# Altium schematic sheet High-Speed-Line-Follower.SchDoc
size 420 x 297 mm; SheetNumber: 1; SheetTotal: 1
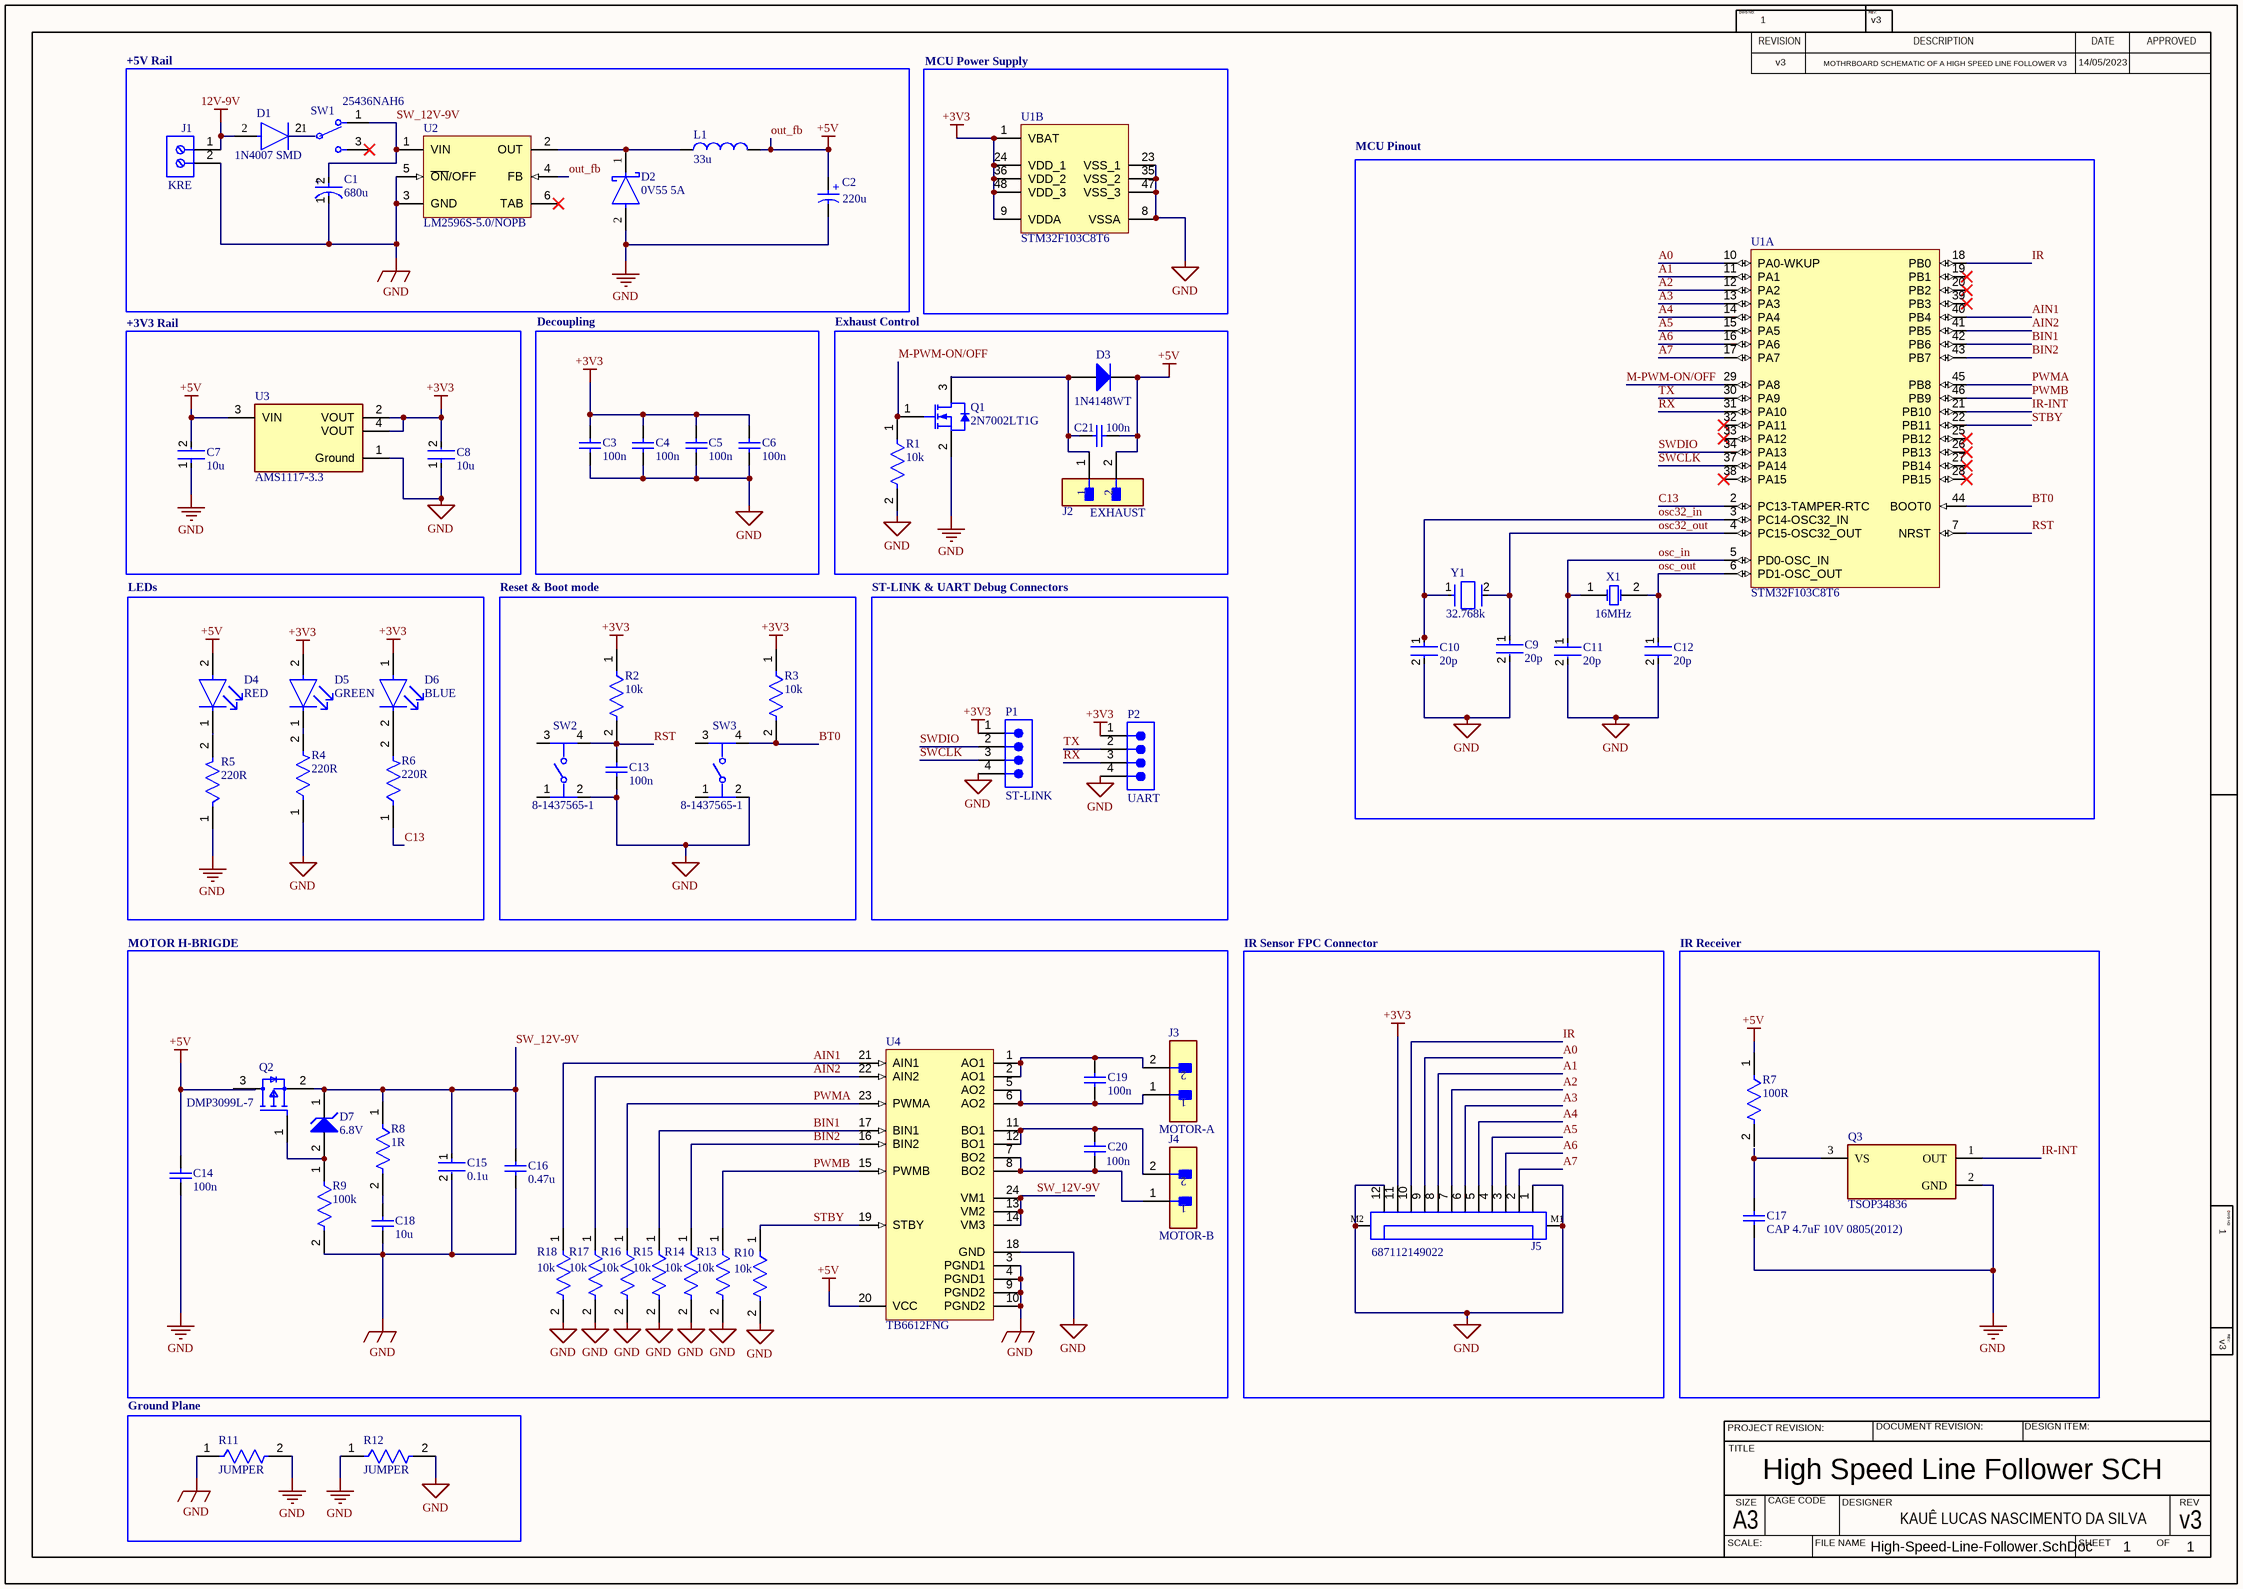
[diagram p0: High-Speed-Line-Follower.SchDoc]

## Parts
C1  680u  [FP-OS-CON-SMT-E12-MFG]
C2  220u  [WCAP-ASLI_D6.3H7.7]
C3  100n  [CAPC2013X145X50ML20T20]
C4  100n  [CAPC2013X145X50ML20T20]
C5  100n  [CAPC2013X145X50ML20T20]
C6  100n  [CAPC2013X145X50ML20T20]
C7  10u  [FP-C0805C106K8RACAUTO-MFG]
C8  10u  [FP-C0805C106K8RACAUTO-MFG]
C9  20p  [FP-C0805C-DN-MFG]
C10  20p  [FP-C0805C-DN-MFG]
C11  20p  [FP-C0805C-DN-MFG]
C12  20p  [FP-C0805C-DN-MFG]
C13  100n  [CAPC2013X140X45LL15T25]
C14  100n  [CAPC2013X140X45LL15T25]
C15  0.1u  [FP-C0805C-DN-MFG]
C16  0.47u  [CAPC2013X140X50ML20T25]
C17  CAP 4.7uF 10V 0805(2012)  [CAPC0805(2012)155_L]
C18  10u  [CAPC2013X145X50ML20T25]
C19  100n  [CAPC2013X140X45LL15T25]
C20  100n  [CAPC2013X140X45LL15T25]
C21  100n  [CAPC2013X140X45LL15T25]
D1  1N4007 SMD  [FP-1N4007_SMD-IPC_C]
D2  0V55 5A  [FP-DO-214AA-MFG]
D3  1N4148WT  [FAIR-SOD-523F-2_V]
D4  RED  [FP-SML-LXT0805IW-TR-MFG]
D5  GREEN  [FP-LTST-C171GKT-MFG]
D6  BLUE  [FP-SM0805UBWC-MFG]
D7  6.8V  [ONSC-SMB-2-403A-03_H_V]
J1  KRE  [691502710002]
J2  EXHAUST  [FP-B2B-XH-A_LF_SN-MFG]
J3  MOTOR-A  [FP-B2B-XH-A_LF_SN-MFG]
J4  MOTOR-B  [FP-B2B-XH-A_LF_SN-MFG]
J5  687112149022  [687112149022]
L1  33u  [SUMI-CDRH127_V]
P1  ST-LINK  [61300411121]
P2  UART  [61300411121]
Q1  2N7002LT1G  [ONSC-SOT-23-3-318-08_V]
Q2  DMP3099L-7  [FP-SOT23-IPC_B]
Q3  TSOP34836  [FP-6_550-5169_01-4-MFG]
R1  10k  [FP-CRGCQ0805-IPC_C]
R2  10k  [FP-CRGCQ0805-IPC_C]
R3  10k  [FP-CRGCQ0805-IPC_C]
R4  220R  [FP-AC0805-MFG]
R5  220R  [FP-AC0805-MFG]
R6  220R  [FP-AC0805-MFG]
R7  100R  [FP-CRCW0805-HPe3-IPC_C]
R8  1R  [FP-CRCW0805-e3-IPC_C]
R9  100k  [FP-MCU0805-IPC_C]
R10  10k  [FP-CRGCQ0805-IPC_C]
R11  JUMPER  [FP-HCJ0805-MFG]
R12  JUMPER  [FP-HCJ0805-MFG]
R13  10k  [FP-CRGCQ0805-IPC_C]
R14  10k  [FP-CRGCQ0805-IPC_C]
R15  10k  [FP-CRGCQ0805-IPC_C]
R16  10k  [FP-CRGCQ0805-IPC_C]
R17  10k  [FP-CRGCQ0805-IPC_C]
R18  10k  [FP-CRGCQ0805-IPC_C]
SW1  25436NAH6  [FP-25436NAH6-MFG]
SW2  8-1437565-1  [FP-8-1437565-1-MFG]
SW3  8-1437565-1  [FP-8-1437565-1-MFG]
U1  STM32F103C8T6  [STM-LQFP48_L]  (parts A,B of 2)
U2  LM2596S-5.0/NOPB  [KTT0005B_M]
U3  AMS1117-3.3  [FP-AMS1117-IPC_C]
U4  TB6612FNG  [TOSH-SSOP-24_M]
X1  16MHz  [CTS-ATS-SM-XTAL-2]
Y1  32.768k  [FP-NX2012SA-MFG]

## Blocks framed on the sheet
+5V Rail: C1 C2 D1 D2 J1 L1 SW1 U2
MCU Power Supply: U1
MCU Pinout: C9-C12 U1 X1 Y1
+3V3 Rail: C7 C8 U3
Decoupling: C3-C6
Exhaust Control: C21 D3 J2 Q1 R1
LEDs: D4-D6 R4-R6
Reset & Boot mode: C13 R2 R3 SW2 SW3
ST-LINK & UART Debug Connectors: P1 P2
MOTOR H-BRIGDE: C14-C16 C18-C20 D7 J3 J4 Q2 R8-R10 R13-R18 U4
IR Sensor FPC Connector: J5
IR Receiver: C17 Q3 R7
Ground Plane: R11 R12

## Nets
12V-9V: D1.2(A) J1.1
+3V3: C3.2 C4.2 C5.2 C6.2 C8.2 D6.1(A) J5.11 P1.1 P2.1 R2.1 R3.1 U1.1(VBAT) U1.9(VDDA) U1.24(VDD_1) U1.36(VDD_2) U1.48(VDD_3) U3.2(VOUT) U3.4(VOUT)
GND: C1.1(C) C2.2(N) C3.1 C4.1 C5.1 C6.1 C7.1 C8.1 C9.2 C10.2 C11.2 C12.2 C13.1 C14.1 C15.2 C16.1 C17.1 C18.1 D2.2(A) J1.2 J5.1 J5.12 J5.M1 J5.M2 P1.4 P2.4 Q1.2(S) Q3.2(GND) R1.2 R4.1 R5.1 R9.2 R10.2 R11.1 R11.2 R12.1 R12.2 R13.2 R14.2 R15.2 R16.2 R17.2 R18.2 SW2.2 SW3.2 U1.8(VSSA) U1.23(VSS_1) U1.35(VSS_2) U1.47(VSS_3) U2.3(GND) U2.5(~{ON}/OFF) U3.1(Ground) U4.3(PGND1) U4.4(PGND1) U4.9(PGND2) U4.10(PGND2) U4.18(GND)
out_fb: C2.1(P) C7.2 C14.2 C21.1 D3.1(K) D4.2(A) J2.2 L1.2 R7.1 U2.4(FB) U3.3(VIN) U4.20(VCC)  [also labelled +5V]
A0: J5.9 U1.10(PA0-WKUP)
A1: J5.8 U1.11(PA1)
A2: J5.7 U1.12(PA2)
A3: J5.6 U1.13(PA3)
A4: J5.5 U1.14(PA4)
A5: J5.4 U1.15(PA5)
A6: J5.3 U1.16(PA6)
A7: J5.2 U1.17(PA7)
AIN1: R18.1 U1.40(PB4) U4.21(AIN1)
AIN2: R17.1 U1.41(PB5) U4.22(AIN2)
BIN1: R15.1 U1.42(PB6) U4.17(BIN1)
BIN2: R14.1 U1.43(PB7) U4.16(BIN2)
BT0: R3.2 SW3.4 U1.44(BOOT0)
C13: R6.1 U1.2(PC13-TAMPER-RTC)
IR: J5.10 U1.18(PB0)
IR-INT: Q3.1(OUT) U1.21(PB10)
M-PWM-ON/OFF: Q1.1(G) R1.1 U1.29(PA8)
osc32_in: C10.1 U1.3(PC14-OSC32_IN) Y1.1
osc32_out: C9.1 U1.4(PC15-OSC32_OUT) Y1.2
osc_in: C11.1 U1.5(PD0-OSC_IN) X1.1(X1)
osc_out: C12.1 U1.6(PD1-OSC_OUT) X1.2(X2)
PWMA: R16.1 U1.45(PB8) U4.23(PWMA)
PWMB: R13.1 U1.46(PB9) U4.15(PWMB)
RST: C13.2 R2.2 SW2.4 U1.7(NRST)
RX: P2.3 U1.31(PA10)
STBY: R10.1 U1.22(PB11) U4.19(STBY)
SW_12V-9V: C1.2(A) C15.1 C16.2 D7.1(K) Q2.2(S) R8.1 SW1.1 U2.1(VIN) U4.13(VM2) U4.14(VM3) U4.24(VM1)
SWCLK: P1.3 U1.37(PA14)
SWDIO: P1.2 U1.34(PA13)
TX: P2.2 U1.30(PA9)
NetC17_2: C17.2 Q3.3(VS)
NetC18_2: C18.2 R8.2
NetC19_1: C19.1 J3.1 U4.5(AO2) U4.6(AO2)
NetC19_2: C19.2 J3.2 U4.1(AO1) U4.2(AO1)
NetC20_1: C20.1 J4.1 U4.7(BO2) U4.8(BO2)
NetC20_2: C20.2 J4.2 U4.11(BO1) U4.12(BO1)
NetC21_2: C21.2 D3.2(A) J2.1
NetD1_1: D1.1(C) SW1.2
NetD2_1: D2.1(C) L1.1 U2.2(OUT)
NetD4_1: D4.1(C) R5.2
NetD5_1: D5.1(C) R4.2
NetD6_2: D6.2(C) R6.2
NetD7_2: D7.2(A) Q2.1(G) R9.1

Not connected (* = marked no-connect by the designer): D5 2(A); Q1 3(D); Q2 3(D); R7 2; SW1 3*; SW2 1 3; SW3 1 3; U1 19(PB1)* 20(PB2)* 25(PB12)* 26(PB13)* 27(PB14)* 28(PB15)* 32(PA11)* 33(PA12)* 38(PA15)* 39(PB3)*; U2 6(TAB)*

## Notes on the sheet
- Labels drawn without touching a wire or pin: +3V3
- DWG NO:
- REVISION
- 1
- REV:
- v3
- DESCRIPTION
- DATE
- APPROVED
- MOTHRBOARD SCHEMATIC OF A HIGH SPEED LINE FOLLOWER V3
- 14/05/2023
- PROJECT REVISION:
- TITLE
- DOCUMENT REVISION:
- DESIGN ITEM:
- SCALE:
- A3
- SIZE
- High Speed Line Follower SCH
- CAGE CODE
- FILE NAME
- DESIGNER
- KAUÊ LUCAS NASCIMENTO DA SILVA
- SHEET
- OF
- REV
- (in symbol CMP-03913-53914576-2) +
- (in symbol CMP-05428-001321-1) +

## Library data of the parts
C1 = CMP-05428-001321-1: Conductive Polymer Aluminum Solid Capacitors (OS-CON) 680uF ±20% 16V; ESR (Equivalent Series Resistance): 14mR; Life (Hours): 1000Hour; Capacitance: 680uF; Packaging: Tape and Reel; Tolerance: 20%; Mount: Surface Mount; Case/Package: Radial; Voltage Rating: 16V; Min Operating Temperature: -55°C; Max Operating Temperature: 125°C
C2 = CMP-03913-53914576-2: WCAP-ASLI Aluminum Electrolytic Capacitors; Insulation Resistance: 454.545kΩ; Voltage Rating (DC): 16V; Life (Hours): 2000hours; ESR (Equivalent Series Resistance): 363.323mΩ; Capacitance: 220µF; Ripple Current (AC): 275mA; Impedance: 430mΩ; Leakage Current: 35.2µA; Height: 7.7mm; Case/Package: Radial; REACH SVHC: Unknown; Diameter: 6.3mm; Voltage Rating: 16V; Width: 6.6mm; Packaging: Cut Tape; Max Operating Temperature: 105°C; RoHS: Compliant; Length: 7.7mm; Min Operating Temperature: -55°C; Ripple Current: 275mA
C3-C6 = CMP-1036-04409-2: Manufacturer: Vitramon; Part Number: VJ0805Y104JXXCW1BC
C7 C8 = CMP-03020-034662-1: CAP CER 10UF 10V X7R 0805; Tolerance: 10%; Case/Package: 0805; Ratings: AEC-Q200; Packaging: Tape and Reel; Voltage Rating: 10V; Max Operating Temperature: 125°C; Min Operating Temperature: -55°C; Case Code (Metric): 2012; Case Code (Imperial): 0805; Mount: Surface Mount; RoHS Compliant: Yes; Capacitance: 10uF
C9-C12 = CMP-03020-007860-1: C0805 20 pF X8R 30ppm/°C 2.00% 10 V; Manufacturer: KEMET; Manufacturer Part Number: C0805C200G8HACTU; Tolerance: 0.02; Value: 20 pF; Material: Ceramic; Voltage Rating: 10 V; Device Class L1: Passive Components; Octopart: https://octopart.com/c0805c200g8hactu-kemet-88726762; Temperature Range High: +125°C; Capacitance: 20 pF; Temperature Coefficient: 30ppm/°C; Temperature Characteristic: X8R; Lead Free: Yes; Height: 0.88mm; Temperature Range Low: -55°C; Device Class L3: Ceramic Capacitors; Package: C0805C-DN; Automotive: No; ComponentLink2URL: https://content.kemet.com/datasheets/KEM_C1003_C0G_SMD.pdf; Device Class L2: Capacitors; Ipc Land Pattern Name: CAPC200125X78; ComponentLink2Description: Datasheet; Temperature: -55°C to +125°C; RoHS: TRUE; Category: Cap
C13 C14 C19-C21 = CMP-2007-03344-1: Part Number: GCM21BR71E104KA37L; Manufacturer: Murata
C15 = CMP-2007-00279-2: CAP CER 0.1UF 50V X7R 0805; Manufacturer Part Number: C0805C104K5RACTU; Manufacturer: KEMET; Value: 0.10 μF; Tolerance: 0.1; Temperature Coefficient: 30ppm/°C; Material: Ceramic; Device Class L2: Capacitors; Temperature Range Low: -55°C; Voltage Rating: 50 V; Digikey Description: CAP CER 0.1UF 50V X7R 0805; Category: Cap; ComponentLink2Description: Datasheet; Octopart: https://octopart.com/c0805c104k5ractu-kemet-143926; RoHS: TRUE; ComponentLink2URL: https://content.kemet.com/datasheets/KEM_C1003_C0G_SMD.pdf; Temperature Characteristic: X7R; Temperature: -55°C to +125°C; Height: 0.88mm; Temperature Range High: +125°C; Device Class L1: Passive Components; Automotive: No; Lead Free: Yes; Ipc Land Pattern Name: CAPC200125X78; Device Class L3: Ceramic Capacitors; Mouser Description: Cap Ceramic 0.1uF 50V X7R 10% SMD 2.0 x 1.2 mm 125 C Paper T/R; Capacitance: 0.10 μF; Package: C0805C-DN
C16 = CMP-2007-03294-1: Part Number: C0805C474K3NACTU; Manufacturer: Kemet
C17 = CMP-1036-04882-1: CAP 4.7uF 10V ±10% 0805 (2012 Metric) Thickness 1.55mm SMD; Case-EIA: 0805; Tolerance: Â±10%; Case-Metric: 2012; Rated Voltage: 10 V; Max Thickness: 1.55 mm; Technology: SMT; Value: 4.7uF
C18 = CMP-2007-01018-1: Part Number: C0805C106M4PACTU; Manufacturer: Kemet
D1 = CMP-12389-000001-1: Rectifier, 1Kv, 1A, Do-214Ac Rohs Compliant: Yes
D2 = CMP-00252-99177889-1: 5819SMJE3/TR13 Rectifier Diode, Schottky, 1 Phase, 1 Element, 1A, 40V V(RRM), Silicon; Peak Non-Repetitive Surge Current: 50A; Peak Reverse Current: 1mA; Element Configuration: Single; Capacitance: 50pF; Forward Voltage: 850mV; Max Junction Temperature (Tj): 150°C; Schedule B: 8541100080; Packaging: Tape & Reel (TR); Max Reverse Voltage (DC): 40V; Height: 2.41mm; Lead Free: Lead Free; Number of Pins: 2; Radiation Hardening: No; Average Rectified Current: 1A; Max Forward Surge Current (Ifsm): 50A; Max Repetitive Reverse Voltage (Vrrm): 40V; Case/Package: SMB; Reverse Voltage: 40V; NexarPartId: 99177889; Min Operating Temperature: -55°C; Lifecycle Status: Production; Max Operating Temperature: 150°C; RoHS: Compliant; Mount: Surface Mount; Forward Current: 1A; Reverse Voltage (DC): 40V
D3 = CMP-0881-00001-1: High Conductance Fast Switching Diode, 75 V, -55 to 150 degC, 2-Pin SOD523F, RoHS; Manufacturer: Fairchild Semiconductor; IR (VR: 75 V)=5 uA Max.; VF: 1 V Max.; BVR (IR: 5 uA)=75 V Min.; CO: 4 pF Max.; DatasheetVersion: Rev. A2; ComponentLink1Description: Manufacturer URL; PackageDescription: 2-Pin Surface Mount Device, Body 1.2 x 0.8 mm, Height 0.7 mm; ComponentLink2URL: http://www.fairchildsemi.com/ds/1N/1N4148WT.pdf; ComponentLink2Description: Datasheet; PartNumber: 1N4148WT; ComponentLink1URL: http://www.fairchildsemi.com/; Temperature Range: -55 to 150 degC; Mounting Technology: Surface Mount; PackageReference: SOD-523F-2; RoHS: TRUE
D4 = CMP-1724-00002-2: LED RED DIFFUSED SMD; Lens Style: Rectangular; Luminous Intensity: 11mcd; Approvals: UL; Test Current: 20mA; Forward Voltage: 2V; Number of LEDs: 1; Wavelength: 635nm; Lens Color: White; Viewing Angle: 140°; Min Operating Temperature: -25°C; Case Code (Metric): 2012; Mount: Surface Mount; Case Code (Imperial): 0805; Height: 0.8mm; Lead Free: Lead Free; Color: Red; Package Quantity: 1; Illumination Color: Red; Lens Transparency: Diffused; Forward Current: 20mA; Packaging: Tape and Reel; Length: 2mm; Case/Package: 0805; REACH SVHC: No SVHC; Width: 1.25mm; Number of Pins: 2; Max Operating Temperature: 80°C; Dominant Wavelength: 635nm
D5 = CMP-22017-000007-1: LED GREEN CLEAR CHIP SMD; Luminous Intensity: 12mcd; Lens Color: Colorless; Dominant Wavelength: 569nm; Number of LEDs: 1; Power Dissipation: 100mW; Viewing Angle: 130°; Reverse Voltage: 5V; Test Current: 10mA; Forward Voltage: 2.1V; Wavelength: 585nm; Lens Style: Diffused; Forward Current: 30mA; Height: 0.8mm; Mount: Surface Mount; Package Quantity: 1; Length: 2mm; Case Code (Metric): 2012; Number of Pins: 2; Number of Elements: 1; Packaging: Tape and Reel; Color: Green; Min Operating Temperature: -55°C; Case/Package: 0805; Power Rating: 100mW; Max Operating Temperature: 85°C; Radiation Hardening: No; Depth: 1.25mm; Lens Transparency: Clear; Width: 1.25mm; Lead Free: Lead Free; Case Code (Imperial): 0805; Illumination Color: Green
D6 = CMP-35283-000004-1: LED BLUE CLEAR 0805 SMD; Dominant Wavelength: 470nm; Forward Voltage: 3.3V; Forward Current: 20mA; Lens Color: Colorless; Lens Style: Rectangular; Luminous Intensity: 115mcd; Viewing Angle: 130°; Power Rating: 100mW; Lens Transparency: Clear; Height: 1.1mm; Mount: Surface Mount; Packaging: Tape and Reel; Package Quantity: 3000; Illumination Color: Blue; Width: 1.2mm; Min Operating Temperature: -30°C; Case Code (Imperial): 0805; Length: 2mm; Test Current: 20mA; Max Operating Temperature: 80°C; Case Code (Metric): 2012; Color: Blue; Wavelength: 470nm; Case/Package: 0805; Lead Free: Lead Free; Number of Pins: 2
D7 = CMP-1060-00231-1: 3 W Zener Voltage Regulator, 2-Pin SMB, Pb-Free, Tape and Reel; PartNumber: 1SMB5921BT3G; Manufacturer: On Semiconductor; VZ Typ (V): 6.8; ComponentLink2URL: http://www.onsemi.com/pub_link/Collateral/1SMB5913BT3-D.PDF; ComponentLink1URL: http://www.onsemi.com/; PackageDescription: 2-Pin Small Molded Package, J-Bend Lead, Body 4.33 x 3.625 mm; ComponentLink2Description: Datasheet; Packing: Tape and Reel; ComponentLink1Description: Manufacturer URL; ComponentLink3URL: http://www.onsemi.com/pub_link/Collateral/1SMB5913BT3-D.PDF; DatasheetVersion: Rev. 8; RoHS: Pb-Free; ComponentLink3Description: Package Specification; PackageReference: SMB-2-403A-03_H; PackageVersion: Rev. H, 05/2011; Mounting Technology: Surface Mount
J1 = CMP-1502-03333-3: Terminal Block, Wtb, 2Way, 22-14Awg Rohs Compliant: Yes; Pitch: 5mm; Number of Pins: 2; Max Operating Temperature: 130°C; Min Operating Temperature: -45°C; Length: 10mm; Packaging: Box
J2-J4 = CMP-2000-05888-3: CONN HEADER VERT 2POS 2.5MM; Current Rating: 3A; Voltage Rating: 250V; Number of Contacts: 2; Contact Resistance: 20mR; Wire/Cable Gauge: 22AWG; Insulation Resistance: 1GR; Connector Type: Male Pin; Packaging: Bulk; Contact Material: Brass; Lead Free: Lead Free; Orientation: Straight; Contact Plating: Tin; Max Current Rating: 3A; Termination: Solder; Fastening Type: Detent; Depth: 5.75mm; Housing Material: Polyamide; REACH SVHC: No SVHC; Series: XH; Voltage Rating (AC): 250V; Number of Positions: 2; Color: Natural; Contact Type: Male Pin; Max Voltage Rating (DC): 250V; Pitch: 2.5mm; Lead Pitch: 2.5mm; Mount: Through Hole; Max Operating Temperature: 85°C; Length: 7.4mm; Max Voltage Rating (AC): 250V; Min Operating Temperature: -25°C; Number of Rows: 1; Housing Color: White
J5 = CMP-1502-01626-3: FFC/FPC Connector, 12 Contact(s), 1 Row(s), Female, Right Angle, Surface Mount Terminal; Pitch: 500µm; Operating Supply Voltage: 50V; Current Rating: 500mA; Insulation Resistance: 500MΩ; Wire/Cable Type: Straight; Contact Resistance: 50mΩ; Gender: Receptacle; Number of Contacts: 12; Actuator Material: Nylon, Polyamide; Max Operating Temperature: 105°C; Contact Plating: Tin; Mount: Surface Mount; RoHS: Compliant; Number of Pins: 12; Length: 6.6mm; Min Operating Temperature: -40°C; Lead Pitch: 500µm; Packaging: Tape and Reel; Voltage Rating: 50V; Number of Rows: 1; Contact Material: Bronze; Termination: Solder; Flammability Rating: UL94 V-0; Number of Positions: 12; REACH SVHC: Unknown; Orientation: Horizontal
L1 = CMP-2000-06084-1: Power Inductor, 10 uH, +/- 20%, -40 to 100 degC, 2-Pin SMD, RoHS, Tape and Reel; Manufacturer: Sumida; Catalog Drawings: CDRH127SeriesFrontCDRH127SeriesSideCDRH127SeriesBottom; Product Training Modules: PowerInductorBasics; Current Rating: 5.4A; Shielding: Shielded; Online Catalog: CDRHSeries; DC Resistance (DCR): 21.6mOhmMax; Other Names: 308-1457-1; Inductance: 10µH; Frequency - Test: 1kHz; Mounting Type: SurfaceMount; Datasheet Version: 01/2014; Package Description: 2-Pin Surface Mount Device, Body 12 x 12 mm; Frequency - Self Resonant: -; Package Reference: CDRH127; Category: Inductors,Coils,Chokes; Material - Core: -; Q @ Freq: -; Type: -; Family: FixedInductors; Ratings: -; Series: CDRH127; Manufacturer URL: http://www.sumida.com/; Operating Temperature: -40°C~100°C; Height - Seated (Max): 0.315"(8.00mm); Standard Package: 1; Size / Dimension: 0.472"Lx0.472"W(12.00mmx12.00mm); Current - Saturation: -; Datasheet URL: http://products.sumida.com/products/pdf/CDRH127.pdf; Package / Case: Nonstandard; Tolerance: ±20%; Mounting Technology: SurfaceMount; Packaging: CutTape(CT)
P1 P2 = CMP-1502-01064-4: THT Vertical Pin Header WR-PHD, Pitch 2.54 mm, Single Row, 4 pins; Connector Type: Male Pin; Gender: Male; Current Rating: 3A; Number of Positions: 4; Operating Supply Voltage: 250V; Contact Resistance: 20mΩ; Pitch: 2.54mm; Max Operating Temperature: 105°C; Mount: Through Hole; Contact Material: Gold; Contact Plating: Gold; Number of Contacts: 4; Orientation: Vertical; Packaging: Bulk; Contact Mating Length: 5.9944mm; Voltage Rating: 250V; Number of Rows: 1; Height: 8.89mm; Lead Free: Lead Free; Lead Pitch: 2.54mm; Number of Pins: 4; Color: Black; Min Operating Temperature: -40°C; RoHS: Compliant; Termination: Solder
Q1 = CMP-1058-00781-1: Small Signal MOSFET, 60 V, 115 mA, N-Channel, 3-Pin SOT-23, Pb-Free, Tape and Reel; Manufacturer: On Semiconductor; Channel Polarity: N Channel; V(BR)DSS Min (V): 60; ID Max (A): 0.115; VGS Max (V): 20; Configuration: Single; VGS(th) Max (V): 2.5; ComponentLink1URL: http://www.onsemi.com/; ComponentLink3Description: Package Specification; ComponentLink3URL: http://www.onsemi.cn/pub_link/Collateral/318-08.PDF; PackageReference: SOT-23-3-318-08; RoHS: Pb-Free; ComponentLink2URL: http://www.onsemi.com/pub_link/Collateral/2N7002L-D.PDF; ComponentLink1Description: Manufacturer URL; Package Type: SOT-23-3; Packing: Tape and Reel; PartNumber: 2N7002LT1G; DatasheetVersion: Rev. 7; Mounting Technology: Surface Mount; ComponentLink2Description: Datasheet; PackageDescription: 3-Pin Small Outline Transistor, Body 2.92 x 1.3 mm, Pitch 0.95 mm; PackageVersion: Rev. AP, 11/2009
Q2 = CMP-12801-000062-2: MOSFET P-CH 30V SOT23; Gate to Source Voltage (Vgs): 20V; Turn-Off Delay Time: 31ns; Drain to Source Voltage (Vdss): -30V; Fall Time: 15ns; Threshold Voltage: -2.1V; Rise Time: 5ns; Input Capacitance: 563pF; Number of Channels: 1; Drain to Source Resistance: 65mR; Element Configuration: Single; Max Power Dissipation: 1.08W; Turn-On Delay Time: 4.8ns; Continuous Drain Current (ID): 3.8A; Lead Free: Lead Free; Number of Pins: 3; Package Quantity: 3000; Width: 1.4mm; Radiation Hardening: No; Mount: Surface Mount; Case/Package: SOT-23; Contact Plating: Tin; Rds On Max: 65mR; Height: 1.1mm; REACH SVHC: No SVHC; Weight: 0.000282oz; Max Operating Temperature: 150°C; Packaging: Tape and Reel; Min Operating Temperature: -55°C; Length: 3mm
Q3 = CMP-00030-46521050-1: TSOP34836 TSOP348 Series 2.5 to 5.5 V 36 KHz 350 uA 45 m Side View IR Receiver; Wavelength: 950nm; Lead Length: 23.6mm; Min Output Voltage: 100mV; Output Current: 5mA; Viewing Angle: 45°; Sensing Distance: 45m; Operating Supply Current: 350µA; Max Power Dissipation: 10mW; Max Supply Voltage: 5.5V; Min Supply Voltage: 2.5V; Frequency: 36kHz; Nominal Supply Current: 450µA; Height: 6.95mm; REACH SVHC: Unknown; Number of Pins: 3; Max Operating Temperature: 85°C; Schedule B: 8541409500; NexarPartId: 46521050; Orientation: Side View; Mount: Through Hole; Min Operating Temperature: -25°C; Case/Package: Module; RoHS: Compliant; Contact Plating: Tin; Width: 5.6mm; Lead Free: Lead Free; Length: 6mm; Radiation Hardening: No
R1-R3 R10 R13-R18 = CMP-03211-002989-1: CRGCQ 0805 10K 5%; Manufacturer Part Number: CRGCQ0805J10K; Manufacturer: TE Connectivity; Voltage Rating: 150V; Temperature Coefficient: ±100ppm/°C; Resistance: 10KΩ; Value: 10KΩ; Power Rating: 0.125W; Tolerance: 0.05; Automotive Grade: Grade 914; Height: 0.65mm; Lead Free: Yes; Temperature Range High: +155°C; Composition: Thick Film; Temperature Range Low: -55°C; Ambient Temperature Range High: +70°C; Temperature: -55°C to +155°C; Package: CRGCQ0805; Device Class L2: Resistors; RoHS: TRUE; ComponentLink2URL: https://www.te.com/commerce/DocumentDelivery/DDEController?Action=showdoc&DocId=Data+Sheet%7F1773204-3%7F1%7Fpdf%7FEnglish%7FENG_DS_1773204-3_1.pdf%7F4-2176341-923; Series: CRGCQ; Device Class L1: Passive Components; Ipc Land Pattern Name: RESC200125X55; ComponentLink2Description: Datasheet; Category: Res; Digikey Description: CRGCQ 0805 10K 5%; Mouser Description: Res Thick Film 0805 10K Ohm 5% 0.125W(1/8W) ±100ppm/C Pad SMD Automotive T/R; Automotive: Yes; Octopart: https://octopart.com/crgcq0805j10k-te+connectivity-91018201; Device Class L3: Chip SMD Resistors
R4-R6 = CMP-2001-04488-2: RES SMD 220 OHM 1% 1/8W 0805; Manufacturer Part Number: AC0805FR-07220RL; Manufacturer: Yageo; Value: 220Ω; Tolerance: 0.01; Voltage Rating: 150V; Automotive Grade: Grade 0; Automotive: Yes; Composition: Thick Film; Lead Free: Yes; Octopart: https://octopart.com/ac0805fr-07220rl-yageo-26041145; Series: AC; Device Class L1: Passive Components; Temperature: -55°C to +155°C; Device Class L3: Chip SMD Resistors; Package: AC0805; Digikey Description: RES SMD 220 OHM 1% 1/8W 0805; ComponentLink2URL: http://www.yageo.com/documents/recent/PYu-AC_51_RoHS_L_6.pdf; ComponentLink2Description: Datasheet; Resistance: 220Ω; Mouser Description: Thick Film Resistors - SMD 1/8W 220ohm 1% AEC-Q200; Ipc Land Pattern Name: RESC200125X50; Power Rating: 1/8W; Device Class L2: Resistors; Category: Res; Footprint Url: http://www.yageo.com/exep/pages/download/literatures/PYu-R_Mount_10.pdf; Temperature Range Low: -55°C; Height: 0.6mm; Temperature Range High: +155°C; RoHS: TRUE
R7 = CMP-02407-002130-1: RES Thick Film, 100Ω, 5%, 0.5W, 200ppm/°C, 0805; Voltage Rating: 150V; Power Rating: 330mW; Max Power Dissipation: 333mW; Max Operating Temperature: 155°C; Temperature Coefficient: 200ppm/°C; Case Code (Imperial): 0805; Lead Free: Lead Free; Composition: Thick Film; Case/Package: 0805; Package Quantity: 1; Number of Terminations: 2; Contact Plating: Tin; Radiation Hardening: No; Case Code (Metric): 2012; Height: 0.024inch; Features: Automotive AEC-Q200; Length: 0.079inch; Resistance: 100R; Tolerance: 5%; Width: 0.049inch; Packaging: Tape and Reel; Termination: SMD/SMT; Weight: 0.000194oz; Min Operating Temperature: -55°C
R8 = CMP-2001-03651-2: RES Thick Film, 1Ω, 5%, 0.125W, 200ppm/°C, 0805; Max Power Dissipation: 125mW; Voltage Rating: 150V; Case/Package: 0805; Contact Plating: Tin; Width: 1.25mm; Min Operating Temperature: -55°C; Depth: 1.25mm; Temperature Coefficient: 200ppm/°C; Packaging: Tape and Reel; Height: 0.02inch; Number of Pins: 2; Tolerance: 5%; Package Quantity: 1; Voltage Rating (DC): 150V; Military Standard: Not; Power Rating: 125mW; Weight: 0.000194oz; Case Code (Metric): 2012; Composition: Thick Film; Case Code (Imperial): 0805; Radiation Hardening: No; Lead Free: Lead Free; Resistance: 1R; Features: Automotive AEC-Q200; Termination: SMD/SMT; Max Operating Temperature: 155°C; Number of Terminations: 2; Length: 2mm
R9 = CMP-02407-001315-1: RES 1.05K OHM 0.5% 1/5W 0805; Power Rating: 125mW; Resistance: 100kR; Tolerance: 1%; Voltage Rating: 150V; Max Power Dissipation: 200mW; Temperature Coefficient: 50ppm/°C; Contact Plating: Tin; Composition: Thin Film; Min Operating Temperature: -55°C; Length: 2mm; Number of Terminations: 2; Depth: 1.25mm; Package Quantity: 1; Max Operating Temperature: 125°C; Radiation Hardening: No; Military Standard: Not; Case Code (Metric): 2012; Case/Package: 0805; Case Code (Imperial): 0805; Weight: 0.000162oz; Packaging: Tape and Reel; Lead Free: Lead Free; Width: 1.2mm; Height: 0.024inch
R11 R12 = CMP-26527-000104-1: RES 0 OHM JUMPER 1/2W 0805; Resistance: 0mR; Radiation Hardening: No; Case Code (Imperial): 0805; Number of Terminations: 2; Lead Free: Lead Free; Max Operating Temperature: 155°C; Width: 0.049inch; Case Code (Metric): 2012; Height: 0.026inch; Mount: Surface Mount; Min Operating Temperature: -55°C; Packaging: Tape and Reel; Package Quantity: 1; Termination: Wraparound; Length: 0.079inch; RoHS Compliant: Yes; Case/Package: 0805
SW1 = CMP-47022-000005-1: SWITCH SLIDE SPDT 4A 125V; Electrical Life: 10000Cycles; Switch Travel: 4mm; Actuator Type: Standard; Current Rating: 1A; Voltage Rating (DC): 30V; Actuator Material: Nylon; Mechanical Life: 20000Cycles; Actuator Length: 6mm; Contact Resistance: 10mR; Max Voltage Rating (AC): 250V; Switch Function: On-On; Packaging: Bulk; Package Quantity: 100; Contact Material: Silver; Orientation: Straight; Max Operating Temperature: 85°C; Min Operating Temperature: -40°C; Mount: Through Hole; Voltage Rating (AC): 125V; Max Voltage Rating (DC): 30V; Throw Configuration: SPDT; Series: 25000N; Termination: PC Pin
SW2 SW3 = CMP-03407-000016-1: SWITCH TACTILE SPST-NO 0.02A 15V; Actuator Length: 0.4mm; Actuator Material: Brass; Contact Current Rating: 20mA; Switch Travel: 0.25mm; Switch Function: Off-Mom; Electrical Life: 500000Cycles; Contact Resistance: 100mR; Illumination Type: Non-Illuminated; Operating Force: 1.57N; Actuator Type: Standard; Throw Configuration: SPST; Radiation Hardening: No; Orientation: Straight; Packaging: Tape and Reel; Type: Switch; Max Operating Temperature: 85°C; Contact Material: Copper Alloy; Package Quantity: 4000; Max Voltage Rating (DC): 15V; Contact Plating: Silver; Mechanical Life: 500000Cycles; Case/Package: SMD/SMT; RoHS Compliant: Yes; Series: FSMCT; Mount: Surface Mount; Max Current Rating: 20mA; ELV: Compliant; Voltage Rating (DC): 15V; Termination: Gull Wing; Min Operating Temperature: -35°C
U1 = CMP-0237-00215-3: ARM Cortex-M3 32-bit MCU, 64 KB Flash, 20 KB Internal RAM, 37 I/Os, 48-pin LQFP, -40 to 85 degC, Tray; Supply Voltage(Vcc) min (V): 2; Internal RAM Size (kB): 20; FLASH Size (Prog) (kB): 64; A/D Converter: 2x12-bit (10 Channel); I/Os (High Current): 37; Operating Frequency(F) (Processor speed) (MHz): 72; Core: ARM Cortex-M3; ComponentLink3Description: Package Specification; Mounting Technology: Surface Mount; PartNumber: STM32F103C8T6; PackageReference: LQFP48; Packing: Tray; ComponentLink3URL: http://www.st.com/st-web-ui/static/active/en/resource/technical/document/datasheet/DM00058181.pdf; DatasheetVersion: Rev. 16; ComponentLink1URL: http://www.st.com/web/en/home.html; PackageVersion: Rev. 6, 06/2013; ComponentLink2URL: http://www.st.com/st-web-ui/static/active/en/resource/technical/document/datasheet/CD00161566.pdf; ComponentLink1Description: Manufacturer URL; ComponentLink2Description: Datasheet; PackageDescription: 48-Pin Low Profile Quad Flat Package, 7 x 7 mm Body, 0.5 mm Pitch
U2 = CMP-0069-00269-3: SIMPLE SWITCHER® Power Converter 150 KHz 3A Step-Down Voltage Regulator, 5-pin TO-263, Pb-Free; Manufacturer: Texas Instruments; PowerWise: N; PackageTopMarking: NSUZXYTTE#*LM2596S*-5.0 P+; ComponentLink1URL: http://www.ti.com/general/docs/lit/getliterature.tsp?genericPartNumber=LM2596&fileType=pdf; PackageDescription: TO-263, Molded, .400 x .390 x .180in, 5 Lead, .067in Pitch, Surface Mount; RoHS: Y; PinCount: 5; Code_JEDEC: MO-169-AB; ComponentLink1Description: Datasheet URL; PackageReference: KTT0005B; CompType: Switcher
U3 = CMP-209535-000001-1: LDO Voltage Regulators 1A, 3.3V; Manufacturer: Advanced Monolithic Systems; Dropout Voltage: 1.1V; Output Type: Fixed; Nominal Supply Current: 5mA; Max Power Dissipation: 1.2W; Max Supply Voltage: 15V; Number Of Outputs: 1; Standoff Height: 0.64mm; Max Junction Temp: +125°C; Height: 1.8mm; Package: AMS1117; Device Class L2: Power Management ICs; ComponentLink2Description: Datasheet; ComponentLink2URL: http://www.advanced-monolithic.com/pdf/ds1117.pdf; Category: IC; RoHS: TRUE; Automotive: No; Device Class L1: Integrated Circuits (ICs); Output Current: 1A; Device Class L3: Voltage Regulators - Linear; Temperature: -40°C to +125°C; Output Voltage: 3.3V; Manufacturer Part Number: AMS1117-3.3; Temperature Range Low: -40°C; Octopart: https://octopart.com/ams1117-3.3-advanced+monolithic+systems-25899300; Lead Free: Yes; Ipc Land Pattern Name: SOT229P700X180-4; Temperature Range High: +125°C
U4 = CMP-1773-00001-1: Driver IC for Dual DC Motor, 15 V, -20 to 85 degC, 24-Pin SSOP, RoHS, Tape and Reel; Elements: 2; Max Power Dissipation: 200 mW; Max Surge Current: 100 mA; Element Configuration: Common Cathode; Case\Package: TO-236-3; Forward Voltage: 1 V; Peak Reverse Current: 0.1 uA; Forward Current: 70 mA; Recovery Time: 5 ns; Radiation Hardening: No; Packaging: Tape and Reel; ComponentLink2Description: Datasheet; REACH SVHC: No SVHC; ComponentLink2URL: https://toshiba.semicon-storage.com/info/docget.jsp?did=10660&prodName=TB6612FNG; RoHSCompliant: true; DatasheetVersion: Oct-14; PackageDescription: 24-Pin Shrink Small Outline Package Integrated Circuit, Body 7.8 x 5.6 mm, Pitch 0.65 mm; Package Quantity: 3000; Length: 3 mm; Pins: 3; Mount: Surface Mount; ComponentLink1Description: Manufacturer URL; PackageReference: SSOP-24; ComponentLink1URL: http://www.toshiba.com/; Width: 1.4 mm; Max Operating Temperature: 125 degC; Height: 1.1 mm; Min Operating Temperature: -55 degC
X1 = CMP-0585-00002-2: ATS-SM Series Quartz Crystal, 16 MHz, -20 to 70 degC, 11.1 x 4.83 x 4.3mm SMD, RoHS, Tape and Reel; PartNumber: ATS16ASM-1; Manufacturer: CTS Corporation; Shunt Capacitance (C0): 7.0 pF Max; Oscillation Mode: Fundamental or 3rd Overtone; Crystal Cut: AT-Cut; ESR Maximum: 40 Ohms; Drive Level (Type): 100 uW; PackageDescription: 2-Pin SMD, Body 11.1 x 4.83 mm, Pitch 8.5 mm; PackageReference: ATS-SM-XTAL-2; ComponentLink1URL: http://www.ctscorp.com/; Frequency: 16 MHz; RoHS: TRUE; ComponentLink1Description: Manufacturer URL; Operating Temperature: -20 to 70 degC; DatasheetVersion: Rev. K; ComponentLink2Description: Datasheet; Packing: Tape and Reel; ComponentLink2URL: http://www.ctscorp.com/components/Datasheets/008-0309-0.pdf; Mounting Technology: Surface Mount; ComponentLink3URL: http://www.ctscorp.com/components/Datasheets/008-0309-0.pdf; ComponentLink3Description: Package Specification
Y1 = CMP-200220-000019-1: CRYSTAL 32.7680KHZ 12.5PF SMD; Frequency Tolerance: 20ppm; ESR (Equivalent Series Resistance): 80kR; Frequency: 32.768kHz; Mount: Surface Mount; Packaging: Cut Tape; Min Operating Temperature: -40°C; Max Operating Temperature: 85°C; Case/Package: SMD/SMT; RoHS Compliant: Yes; Length: 0.081inch; Series: NX2012SA; Height: 0.024inch; Width: 0.047inch; Load Capacitance: 12.5pF